# EasyEDA Pro project 数控UPS.epro, schematic Schematic1_1
Board Name: Board1_1; Create Date: 2025-03-17; Page Name: P1; Project Name: SC8815 双向升降压模块 第二版; Schematic Name: Schematic1_1; Update Date: 2025-03-17; Company: 嘉立创EDA; Page Size: A4; Version: V1.0
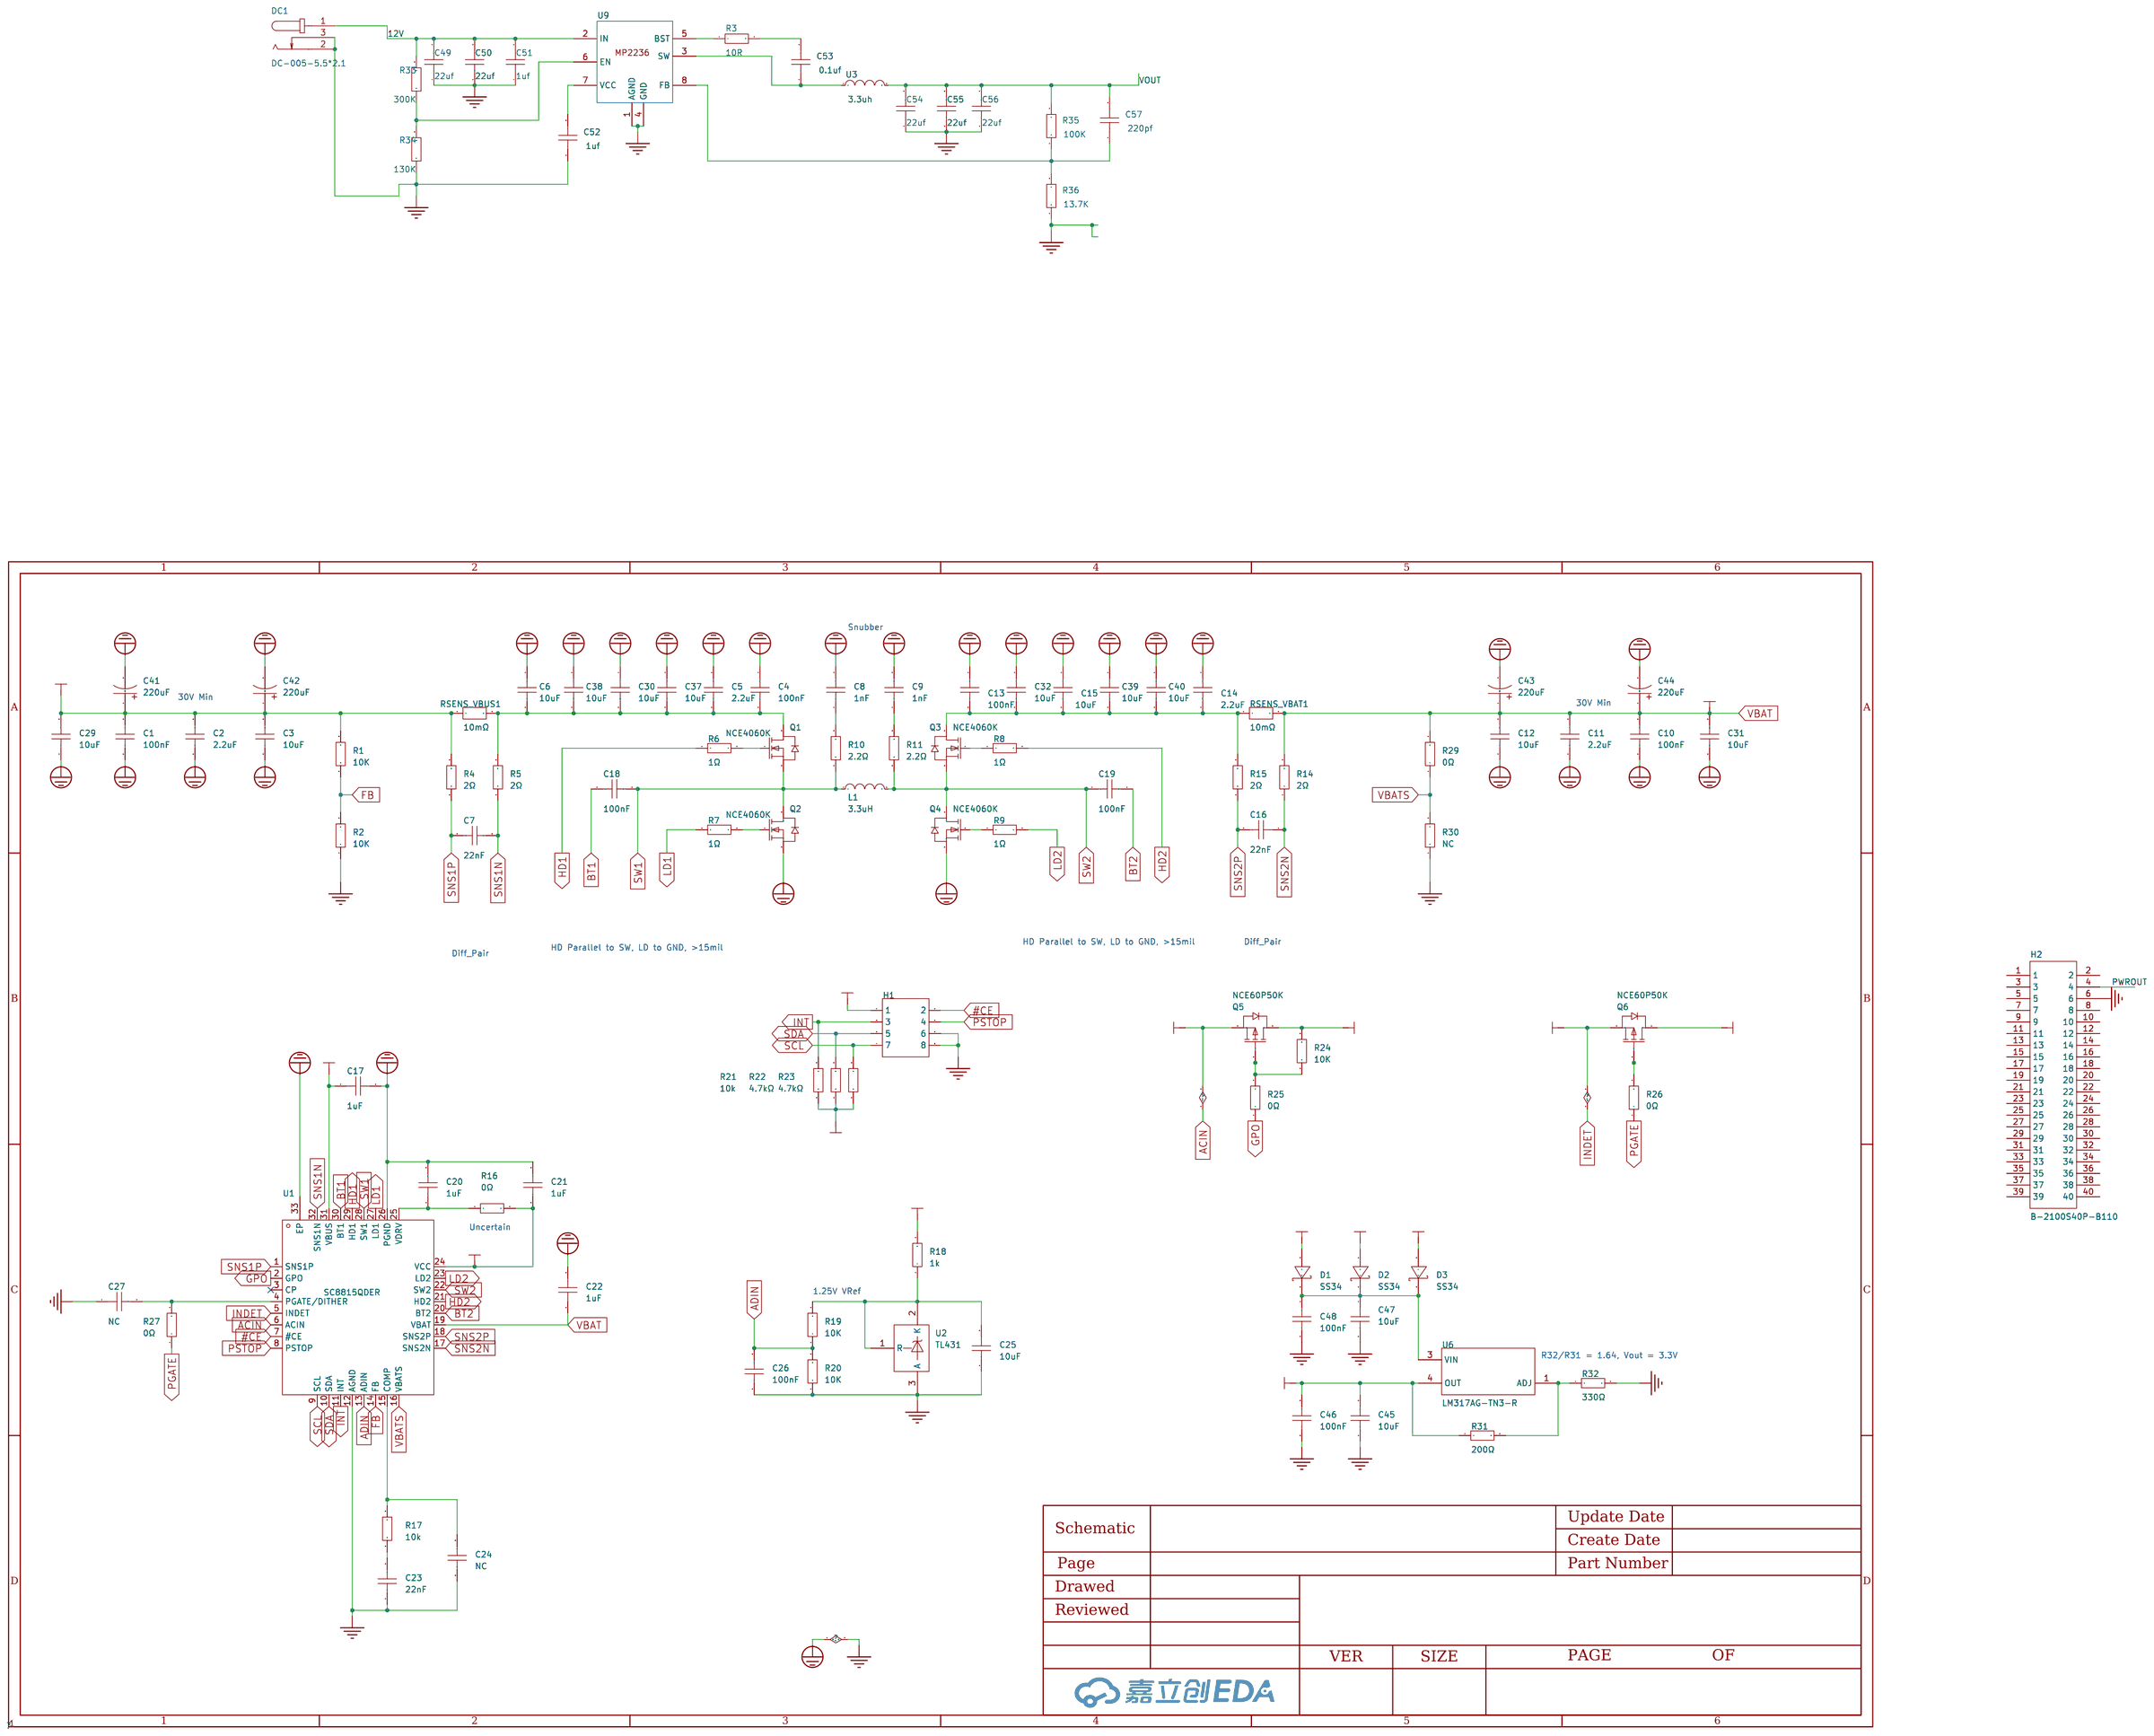
[diagram p1: schematic sheet]

## Parts
C1  100nF  [C0603]
C2  2.2uF  [C0805]
C3  10uF  [C0805]
C4  100nF  [C0603]
C5  2.2uF  [C0805]
C6  10uF  [C0805]
C7  22nF  [C0603]
C8  1nF  [C0603]
C9  1nF  [C0603]
C10  100nF  [C0603]
C11  2.2uF  [C0805]
C12  10uF  [C0805]
C13  100nF  [C0603]
C14  2.2uF  [C0805]
C15  10uF  [C0805]
C16  22nF  [C0603]
C17  1uF  [C0603]
C18  100nF  [C0603]
C19  100nF  [C0603]
C20  1uF  [C0603]
C21  1uF  [C0603]
C22  1uF  [C0603]
C23  22nF  [C0603]
C24  NC  [C0603]
C25  10uF  [C0805]
C26  100nF  [C0603]
C27  NC  [C0603]
C29  10uF  [C0805]
C30  10uF  [C0805]
C31  10uF  [C0805]
C32  10uF  [C0805]
C37  10uF  [C0805]
C38  10uF  [C0805]
C39  10uF  [C0805]
C40  10uF  [C0805]
C41  220uF  [CAP-SMD_BD8.0-L8.3-W8.3-FD]
C42  220uF  [CAP-SMD_BD8.0-L8.3-W8.3-FD]
C43  220uF  [CAP-SMD_BD8.0-L8.3-W8.3-FD]
C44  220uF  [CAP-SMD_BD8.0-L8.3-W8.3-FD]
C45  10uF  [C0805]
C46  100nF  [C0603]
C47  10uF  [C0805]
C48  100nF  [C0603]
C49  22uf  [C0805]
C50  22uf  [C0805]
C51  1uf  [C0805]
C52  1uf  [C0805]
C53  0.1uf  [C0805]
C54  22uf  [C0805]
C55  22uf  [C0805]
C56  22uf  [C0805]
C57  220pf  [C0805]
D1  SS34  [SMA_L4.3-W2.6-LS5.2-RD]
D2  SS34  [SMA_L4.3-W2.6-LS5.2-RD]
D3  SS34  [SMA_L4.3-W2.6-LS5.2-RD]
DC1  DC-005-5.5*2.1  [DC-IN-TH_DC-005-2]
H1  -  [HDR-TH_8P-P2.54-V-F-R2-C4-S2.54-1]
H2  B-2100S40P-B110  [HDR-TH_40P-P2.54-V-M-R2-C20-S2.54]
L1  3.3uH  [IND-SMD_L13.5-W12.6]
Q1  NCE4060K  [TO-252-2_L6.6-W6.1-P4.57-LS9.9-TL-CW]
Q2  NCE4060K  [TO-252-2_L6.6-W6.1-P4.57-LS9.9-TL-CW]
Q3  NCE4060K  [TO-252-2_L6.6-W6.1-P4.57-LS9.9-TL-CW]
Q4  NCE4060K  [TO-252-2_L6.6-W6.1-P4.57-LS9.9-TL-CW]
Q5  NCE60P50K  [TO-252-2_L6.6-W6.1-P4.57-LS9.9-TL-CW]
Q6  NCE60P50K  [TO-252-2_L6.6-W6.1-P4.57-LS9.9-TL-CW]
R1  10K  [R0603]
R2  10K  [R0603]
R3  10R  [R0805]
R4  2Ω  [R0603]
R5  2Ω  [R0603]
R6  1Ω  [R0603]
R7  1Ω  [R0603]
R8  1Ω  [R0603]
R9  1Ω  [R0603]
R10  2.2Ω  [R0603]
R11  2.2Ω  [R0603]
R14  2Ω  [R0603]
R15  2Ω  [R0603]
R16  0Ω  [R0603]
R17  10k  [R0603]
R18  1k  [R0603]
R19  10K  [R0603]
R20  10K  [R0603]
R21  10k  [R0603]
R22  4.7kΩ  [R0603]
R23  4.7kΩ  [R0603]
R24  10K  [R0603]
R25  0Ω  [R0603]
R26  0Ω  [R0603]
R27  0Ω  [R0603]
R29  0Ω  [R0603]
R30  NC  [R0603]
R31  200Ω  [R0603]
R32  330Ω  [R0603]
R33  300K  [R0805]
R34  130K  [R0805]
R35  100K  [R0805]
R36  13.7K  [R0805]
RSENS_VBAT1  10mΩ  [R2512]
RSENS_VBUS1  10mΩ  [R2512]
U1  SC8815QDER  [QFN-32_L4.0-W4.0-P0.40-BL-EP2.7]
U2  TL431  [SOT-23-3_L2.9-W1.4-P1.90-LS2.6-BR]
U3  3.3uh  [IND-SMD_L6.8-W6.8_SMMS0630]
U6  LM317AG-TN3-R  [TO-252-2_L6.5-W6.1-P4.58-LS10.0-TL]
U9  -  [MP2236]

## Library data of the parts
C1 C4 C10 C13 C18 C19 C24 C26 C27 C46 C48 = CAP_0603: Supplier Footprint: 0603
C2 C5 C11 C14 = 0805F225M500NT: 容值:2.2uF;精度:±20%;额定电压:50V;材质(温度系数):Y5V;; LCSC Part Name: 2.2uF ±20% 50V; Supplier Part: C49217; Manufacturer: FH(风华); Supplier Footprint: 0805; JLCPCB Part Class: Basic Part; Datasheet: https://atta.szlcsc.com/upload/public/pdf/source/20170923/C49217_1506149476408988807.pdf; Supplier: LCSC; Tolerance: ±20%; Voltage Rated: 50V; Temperature Coefficient: Y5V
C3 C6 C12 C15 C25 C29-C32 C37-C40 C45 C47 = GRM21BR61H106KE43L: 容值:10uF;精度:±10%;额定电压:50V;材质(温度系数):X5R;; LCSC Part Name: 10uF ±10% 50V; Supplier Part: C440198; Manufacturer: muRata(村田); Supplier Footprint: 0805; JLCPCB Part Class: Basic Part; Datasheet: https://atta.szlcsc.com/upload/public/pdf/source/20191220/C440198_2DEA1B9834E321C8893F7972E9DFE5B0.pdf; Supplier: LCSC; Tolerance: ±10%; Voltage Rated: 50V; Temperature Coefficient: X5R
C7 C16 C23 = CL10B223KB8NNNC: 容值:22nF;精度:±10%;额定电压:50V;材质(温度系数):X7R;; LCSC Part Name: 22nF ±10% 50V; Supplier Part: C21122; Manufacturer: SAMSUNG(三星); Supplier Footprint: 0603; JLCPCB Part Class: Basic Part; Datasheet: https://atta.szlcsc.com/upload/public/pdf/source/20160103/1457707705232.pdf; Supplier: LCSC; Tolerance: ±10%; Voltage Rated: 50V; Temperature Coefficient: X7R
C8 C9 = CL10B102KB8NNNC: 容值:1nF;精度:±10%;额定电压:50V;材质(温度系数):X7R;; LCSC Part Name: 1nF ±10% 50V; Supplier Part: C1588; Manufacturer: SAMSUNG(三星); Supplier Footprint: 0603; JLCPCB Part Class: Basic Part; Datasheet: https://atta.szlcsc.com/upload/public/pdf/source/20160103/1457707679526.pdf; Supplier: LCSC; Tolerance: ±10%; Voltage Rated: 50V; Temperature Coefficient: X7R
C17 C20-C22 = CL10A105KB8NNNC: 容值:1uF;精度:±10%;额定电压:50V;材质(温度系数):X5R;; LCSC Part Name: 1uF ±10% 50V; Supplier Part: C15849; Manufacturer: SAMSUNG(三星); Supplier Footprint: 0603; JLCPCB Part Class: Basic Part; Datasheet: https://atta.szlcsc.com/upload/public/pdf/source/20160103/1457707679084.pdf; Supplier: LCSC; Tolerance: ±10%; Voltage Rated: 50V; Temperature Coefficient: X5R
C41-C44 = UUD1V221MNL1GS: 容值:220uF;精度:±20%;额定电压:35V;纹波电流:450mA@100kHz;等效串联电阻:-;; LCSC Part Name: 220uF ±20% 35V; Supplier Part: C251000; Manufacturer: Nichicon(尼吉康); Supplier Footprint: SMD,D8xL10mm; JLCPCB Part Class: Extended Part; Datasheet: https://atta.szlcsc.com/upload/public/pdf/source/20181024/C251000_614D1E5685F25425694409DBBD0D1B5B.pdf; Supplier: LCSC; Tolerance: ±20%; Rated Voltage: 35V; Ripple Current: 450mA@100kHz; Lifetime @ Temp: 5000hrs@105℃; Operating Temperature: -45℃~+105℃
C49-C57 = CAP_0805: Supplier Footprint: 0805
D1-D3 = SS34_C8678: 二极管配置:独立式;直流反向耐压(Vr):40V;平均整流电流(Io):3A;正向压降(Vf):550mV@3A;; LCSC Part Name: 40V 3A 550mV@3A; Supplier Part: C8678; Manufacturer: MDD; Supplier Footprint: SMA(DO-214AC); JLCPCB Part Class: Basic Part; Datasheet: https://atta.szlcsc.com/upload/public/pdf/source/20230314/A80AE34493C69B89E2F4B1712F433538.pdf; Supplier: LCSC; Diode Configuration: 独立式; Reverse Voltage (Vr): 40V; Average Rectified Current (Io): 3A; Forward Voltage (Vf@If): 550mV@3A; Reverse Leakage Current (Ir): 500uA@40V
DC1 = DC-005-5.5*2.1: Supplier Part: C9900017044; Supplier Footprint: DC-005; JLCPCB Part Class: 扩展库; Supplier: LCSC
H1 = HDR-F_2.54_2x4: Supplier Part: C92271; Supplier Footprint: 插件
H2 = B-2100S40P-B110: 插针结构:2x20P;间距:2.54mm;行距:2.54mm;圆针/方针:-;安装方式:直插;排数:双排;总PIN位数:40P;额定电流:-;额定电压:-;配合针长度:6mm;塑高:2.54mm;端接针长度:3mm;触头材质:黄铜;触头镀层:-;工作温度:-40℃~+105℃;颜色:黑色;; LCSC Part Name: 2x20P 间距:2.54mm 直插; Supplier Part: C124383; Manufacturer: Ckmtw(灿科盟); Supplier Footprint: 插件,P=2.54mm; JLCPCB Part Class: 扩展库; Datasheet: https://atta.szlcsc.com/upload/public/pdf/source/20180130/C169817_15172974075481323419.pdf; Supplier: LCSC; Pin Structure: 2x20P; Pitch: 2.54mm; Row Spacing: 2.54mm; Mounting Type: 直插; Number of Rows: 双排; Number of Pins: 40P; Length of Mating Pin: 6mm; Insulation Height: 2.54mm; Length of End Connection Pin: 3mm; Contact Material: 黄铜; Operating Temperature: -40℃~+105℃; Color: 黑色
L1 = MWSA1205S-3R3MT: 类型:-;电感值:3.3uH;精度:±20%;额定电流:14A;饱和电流(Isat):22A;; LCSC Part Name: 3.3uH ±20% 22A; Supplier Part: C408513; Manufacturer: Sunlord(顺络); Supplier Footprint: SMD; JLCPCB Part Class: Extended Part; Datasheet: https://atta.szlcsc.com/upload/public/pdf/source/20190729/C408513_BFFBDB7649BE62A7FBF74C0368CDE79B.pdf; Supplier: LCSC; Tolerance: ±20%; Rated Current: 14A; Saturation Current (Isat): 22A; DC Resistance (DCR): 7mΩ
Q1-Q4 = NCE4060K: 类型:N沟道;漏源电压(Vdss):40V;连续漏极电流(Id):60A;功率(Pd):65W;导通电阻(RDS(on)@Vgs,Id):13mΩ@10V,20A;阈值电压(Vgs(th)@Id):2.5V@250uA;; LCSC Part Name: N沟道 40V 60A; Supplier Part: C150550; Manufacturer: NCE(无锡新洁能); Supplier Footprint: TO-252-2(DPAK); JLCPCB Part Class: Extended Part; Datasheet: https://atta.szlcsc.com/upload/public/pdf/source/20171221/C150550_15138312381201195484.pdf; Supplier: LCSC; Type: N沟道; Drain Source Voltage (Vdss): 40V; Continuous Drain Current (Id): 60A; Power Dissipation (Pd): 65W; Drain Source On Resistance (RDS(on)@Vgs,Id): 13mΩ@10V,20A; Gate Threshold Voltage (Vgs(th)@Id): 2.5V@250uA
Q5 Q6 = NCE60P50K: 类型:P沟道;漏源电压(Vdss):60V;连续漏极电流(Id):50A;功率(Pd):95W;导通电阻(RDS(on)@Vgs,Id):23mΩ@10V,20A;阈值电压(Vgs(th)@Id):3.5V@250uA;; LCSC Part Name: P沟道 60V 50A; Supplier Part: C130104; Manufacturer: NCE(无锡新洁能); Supplier Footprint: TO-252-2(DPAK); JLCPCB Part Class: Extended Part; Datasheet: https://atta.szlcsc.com/upload/public/pdf/source/20170919/C130104_1505787180031976877.pdf; Supplier: LCSC; Type: P沟道; Drain Source Voltage (Vdss): 60V; Continuous Drain Current (Id): 50A; Power Dissipation (Pd): 95W; Drain Source On Resistance (RDS(on)@Vgs,Id): 23mΩ@10V,20A; Gate Threshold Voltage (Vgs(th)@Id): 3.5V@250uA
R1 R2 R17-R20 R24 = Res_0603: Supplier Footprint: 0603
R3 R33-R36 = Res_0805: Supplier Footprint: 0805
R4 R5 R14 R15 = 0603WAF200KT5E: 电阻类型:厚膜电阻;阻值:2Ω;精度:±1%;功率:100mW;; LCSC Part Name: 2Ω ±1% 100mW; Supplier Part: C22977; Manufacturer: UNI-ROYAL(厚声); Supplier Footprint: 0603; JLCPCB Part Class: Basic Part; Datasheet: https://atta.szlcsc.com/upload/public/pdf/source/20200306/C422600_1E6D84923E4A46A82E41ADD87F860B5C.pdf; Supplier: LCSC; Type: 厚膜电阻; Tolerance: ±1%; Power(Watts): 100mW; Temperature Coefficient: ±400ppm/℃; Overload Voltage (Max): 75V; Operating Temperature Range: -55℃~+155℃
R6-R9 = 0603WAF100KT5E: 电阻类型:厚膜电阻;阻值:1Ω;精度:±1%;功率:100mW;; LCSC Part Name: 1Ω ±1% 100mW; Supplier Part: C22936; Manufacturer: UNI-ROYAL(厚声); Supplier Footprint: 0603; JLCPCB Part Class: Basic Part; Datasheet: https://atta.szlcsc.com/upload/public/pdf/source/20200306/C422600_1E6D84923E4A46A82E41ADD87F860B5C.pdf; Supplier: LCSC; Type: 厚膜电阻; Tolerance: ±1%; Power(Watts): 100mW; Temperature Coefficient: ±400ppm/℃; Overload Voltage (Max): 75V; Operating Temperature Range: -55℃~+155℃
R10 R11 = 0603WAF220KT5E: 电阻类型:厚膜电阻;阻值:2.2Ω;精度:±1%;功率:100mW;; LCSC Part Name: 2.2Ω ±1% 100mW; Supplier Part: C22939; Manufacturer: UNI-ROYAL(厚声); Supplier Footprint: 0603; JLCPCB Part Class: Basic Part; Datasheet: https://atta.szlcsc.com/upload/public/pdf/source/20200306/C422600_1E6D84923E4A46A82E41ADD87F860B5C.pdf; Supplier: LCSC; Type: 厚膜电阻; Tolerance: ±1%; Power(Watts): 100mW; Temperature Coefficient: ±400ppm/℃; Overload Voltage (Max): 75V; Operating Temperature Range: -55℃~+155℃
R16 R25-R27 R29 R30 = 0603WAF0000T5E: 电阻类型:厚膜电阻;阻值:0Ω;精度:±1%;功率:100mW;; LCSC Part Name: 0Ω ±1% 100mW; Supplier Part: C21189; Manufacturer: UNI-ROYAL(厚声); Supplier Footprint: 0603; JLCPCB Part Class: Basic Part; Datasheet: https://atta.szlcsc.com/upload/public/pdf/source/20200306/C422600_1E6D84923E4A46A82E41ADD87F860B5C.pdf; Supplier: LCSC; Type: 厚膜电阻; Tolerance: ±1%; Power(Watts): 100mW; Overload Voltage (Max): 75V; Operating Temperature Range: -55℃~+155℃
R21-R23 = 0603WAF4701T5E: 电阻类型:厚膜电阻;阻值:4.7kΩ;精度:±1%;功率:100mW;; LCSC Part Name: 4.7kΩ ±1% 100mW; Supplier Part: C23162; Manufacturer: UNI-ROYAL(厚声); Supplier Footprint: 0603; JLCPCB Part Class: Basic Part; Datasheet: https://atta.szlcsc.com/upload/public/pdf/source/20200306/C422600_1E6D84923E4A46A82E41ADD87F860B5C.pdf; Supplier: LCSC; Type: 厚膜电阻; Tolerance: ±1%; Power(Watts): 100mW; Temperature Coefficient: ±100ppm/℃; Overload Voltage (Max): 75V; Operating Temperature Range: -55℃~+155℃
R31 = 0603WAF1102T5E: 电阻类型:厚膜电阻;阻值:11kΩ;精度:±1%;功率:100mW;; LCSC Part Name: 11kΩ ±1% 100mW; Supplier Part: C25950; Manufacturer: UNI-ROYAL(厚声); Supplier Footprint: 0603; JLCPCB Part Class: Basic Part; Datasheet: https://atta.szlcsc.com/upload/public/pdf/source/20200306/C422600_1E6D84923E4A46A82E41ADD87F860B5C.pdf; Supplier: LCSC; Type: 厚膜电阻; Tolerance: ±1%; Power(Watts): 100mW; Temperature Coefficient: ±100ppm/℃; Overload Voltage (Max): 75V; Operating Temperature Range: -55℃~+155℃
R32 = 0603WAF1802T5E: 电阻类型:厚膜电阻;阻值:18kΩ;精度:±1%;功率:100mW;; LCSC Part Name: 18kΩ ±1% 100mW; Supplier Part: C25810; Manufacturer: UNI-ROYAL(厚声); Supplier Footprint: 0603; JLCPCB Part Class: Basic Part; Datasheet: https://atta.szlcsc.com/upload/public/pdf/source/20200306/C422600_1E6D84923E4A46A82E41ADD87F860B5C.pdf; Supplier: LCSC; Type: 厚膜电阻; Tolerance: ±1%; Power(Watts): 100mW; Temperature Coefficient: ±100ppm/℃; Overload Voltage (Max): 75V; Operating Temperature Range: -55℃~+155℃
RSENS_VBAT1 RSENS_VBUS1 = MFL12HR010FT: 阻值:10mΩ;精度:±1%;功率:2W;; LCSC Part Name: 10mΩ ±1% 2W; Supplier Part: C507406; Manufacturer: FH(风华); Supplier Footprint: 2512; JLCPCB Part Class: Extended Part; Datasheet: https://atta.szlcsc.com/upload/public/pdf/source/20181030/C304402_9F76BC3E660D2D17C05C8642B303DA37.pdf; Supplier: LCSC; Tolerance: ±1%; Power(Watts): 2W; Temperature Coefficient: ±50ppm/℃
U1 = SC8815QDER: LCSC Part Name: SC8815QDER 停产; Supplier Part: C429908; Manufacturer: SOUTHCHIP(南芯); Supplier Footprint: QFN-32-EP(4x4); JLCPCB Part Class: Extended Part; Datasheet: https://atta.szlcsc.com/upload/public/pdf/source/20190920/C429908_533C397936D81F8B56DA958AD55C5F2B.pdf; Supplier: LCSC
U2 = TL431_C963380: 电压基准类型:并联;输出类型:可调;输入电压:37V;输出电压:2.5V~36V;输出电流:-;精度:-;温度系数:50ppm/℃;静态电流:-;最小阴极电流调节:1mA;噪声(0.1Hz-10Hz):-;噪声(10Hz-10kHz):-;动态阻抗:150mΩ;工作温度:-25℃~+85℃@(Topr);; LCSC Part Name: 并联 2.5V~36V; Supplier Part: C963380; Manufacturer: JSMSEMI(杰盛微); Supplier Footprint: SOT-23; JLCPCB Part Class: Extended Part; Datasheet: https://atta.szlcsc.com/upload/public/pdf/source/20211201/EE02BA953BE41909F74D12B934756247.pdf; Supplier: LCSC; Reference Type: 并联; Output Type: 可调; Input Voltage: 37V; Output Voltage: 2.5V~36V; Temperature Coefficient: 50ppm/℃; Minimum Cathode Current for Regulation: 1mA; Dynamic Impedance: 150mΩ; Operating Temperature: -25℃~+85℃@(Topr)
U3 = 贴片电感1ROI: Supplier Part: C9900016446; Supplier Footprint: ND-SMD_L6.8-W6.8_SMMS0630; JLCPCB Part Class: 扩展库; Datasheet: https://atta.szlcsc.comnull; Supplier: LCSC
U6 = LM317AG-TN3-R: Supplier Part: C75510; Manufacturer: UTC(友顺); Supplier Footprint: TO-252-2(DPAK); JLCPCB Part Class: Basic Part; Datasheet: https://atta.szlcsc.com/upload/public/pdf/source/20160620/1466410513852.pdf; Supplier: LCSC
U9 = MP2236

## Nets
3V3: C45.2 C46.2 H1.1 R21.1 R22.1 R23.1 R31.1 U6.4(OUT)
12V: C49.2 C50.2 C51.2 DC1.1 R33.2 U9.2(IN)
+5V_IC: C21.1 R16.2 R18.2 U1.24(VCC)
GND: C1.1 C2.1 C3.1 C4.1 C5.1 C6.1 C8.2 C9.2 C10.1 C11.1 C12.1 C13.1 C14.1 C15.1 C17.2 C20.2 C21.2 C22.2 C23.1 C24.1 C25.1 C26.1 C27.1 C29.1 C30.1 C31.1 C32.1 C37.1 C38.1 C39.1 C40.1 C41.2 C42.2 C43.2 C44.2 C45.1 C46.1 C47.2 C48.2 C49.1 C50.1 C51.1 C52.1 C54.1 C55.1 C56.1 DC1.2 DC1.3 H1.6 H1.8 H2.6 Q2.3(S) Q4.3(S) R2.1 R20.1 R30.1 R32.2 R34.1 R36.1 U1.12(AGND) U1.26(PGND) U1.33(EP) U2.3(A) U9.1(AGND) U9.4(GND)
VBAT: C10.2 C11.2 C12.2 C22.1 C31.2 C43.1 C44.1 D2.2(A) R14.2 R29.2 RSENS_VBAT1.2 U1.19(VBAT)
VBATS: R29.1 R30.2 U1.16(VBATS)
VBUS: C1.2 C2.2 C3.2 C17.1 C29.2 C41.1 C42.1 Q5.3(S) Q6.3(S) R1.2 R4.2 R24.2 RSENS_VBUS1.1 U1.31(VBUS)
#CE: H1.2 U1.7(#CE)
ADIN: C26.2 R19.1 R20.2 U1.13(ADIN)
BT1: C18.1 U1.30(BT1)
BT2: C19.2 U1.20(BT2)
FB: R1.1 R2.2 U1.14(FB)
GPO: R25.1 U1.2(GPO)
HD1: R6.1 U1.29(HD1)
HD2: R8.2 U1.21(HD2)
INT: H1.3 R21.2 U1.11(INT)
LD1: R7.1 U1.27(LD1)
LD2: R9.2 U1.23(LD2)
PGATE: R26.1 R27.1
PSTOP: H1.4 U1.8(PSTOP)
PWRIN: D3.2(A) Q5.2(D) U1.6(ACIN)
PWROUT: D1.2(A) H2.4 Q6.2(D) U1.5(INDET)
SCL: H1.7 R23.2 U1.9(SCL)
SDA: H1.5 R22.2 U1.10(SDA)
SNS1N: C7.2 R5.1 U1.32(SNS1N)
SNS1P: C7.1 R4.1 U1.1(SNS1P)
SNS2N: C16.1 R14.1 U1.17(SNS2N)
SNS2P: C16.2 R15.1 U1.18(SNS2P)
SW1: C18.2 L1.1 Q1.3(S) Q2.2(D) R10.1 U1.28(SW1)
SW2: C19.1 L1.2 Q3.3(S) Q4.2(D) R11.1 U1.22(SW2)
VOUT: C54.2 C55.2 C56.2 C57.2 R35.2 U3.2
$1N5550: Q1.1(G) R6.2
$1N5553: Q2.1(G) R7.2
$1N5556: Q3.1(G) R8.1
$1N5559: Q4.1(G) R9.1
$1N7696: C20.1 R16.1 U1.25(VDRV)
$1N8909: C23.2 R17.1
$1N8945: C24.2 R17.2 U1.15(COMP)
$1N10523: C25.2 R18.1 R19.2 U2.1(R) U2.2(K)
$1N11094: Q5.1(G) R24.1 R25.2
$1N11328: Q6.1(G) R26.2
$1N46207: R31.2 R32.1 U6.1(ADJ)
$1N53072: C47.1 C48.1 D1.1(K) D2.1(K) D3.1(K) U6.3(VIN)
Net-(C4-2): C4.2 C5.2 C6.2 C30.2 C37.2 C38.2 Q1.2(D) R5.2 RSENS_VBUS1.2
Net-(C8-1): C8.1 R10.2
Net-(C9-1): C9.1 R11.2
Net-(C13-2): C13.2 C14.2 C15.2 C32.2 C39.2 C40.2 Q3.2(D) R15.2 RSENS_VBAT1.1
Net-(C27-2): C27.2 R27.2 U1.4(PGATE/DITHER)
Net-(C52-2): C52.2 U9.7(VCC)
Net-(C53-1): C53.1 U3.1 U9.3(SW)
Net-(C53-2): C53.2 R3.2
Net-(C57-1): C57.1 R35.1 R36.2 U9.8(FB)
Net-(R3-1): R3.1 U9.5(BST)
Net-(R33-1): R33.1 R34.2 U9.6(EN)

Not connected (* = marked no-connect by the designer): H2 1 2 3 5 7 8 9 10 11 12 13 14 15 16 17 18 19 20 21 22 23 24 25 26 27 28 29 30 31 32 33 34 35 36 37 38 39 40; U1 3(CP)*

## Notes on the sheet
- Snubber
- 30V Min
- 30V Min
- HD Parallel to SW, LD to GND, >15mil
- Diff_Pair
- Diff_Pair
- HD Parallel to SW, LD to GND, >15mil
- Uncertain
- 1.25V VRef
- R32/R31 = 1.64, Vout = 3.3V
